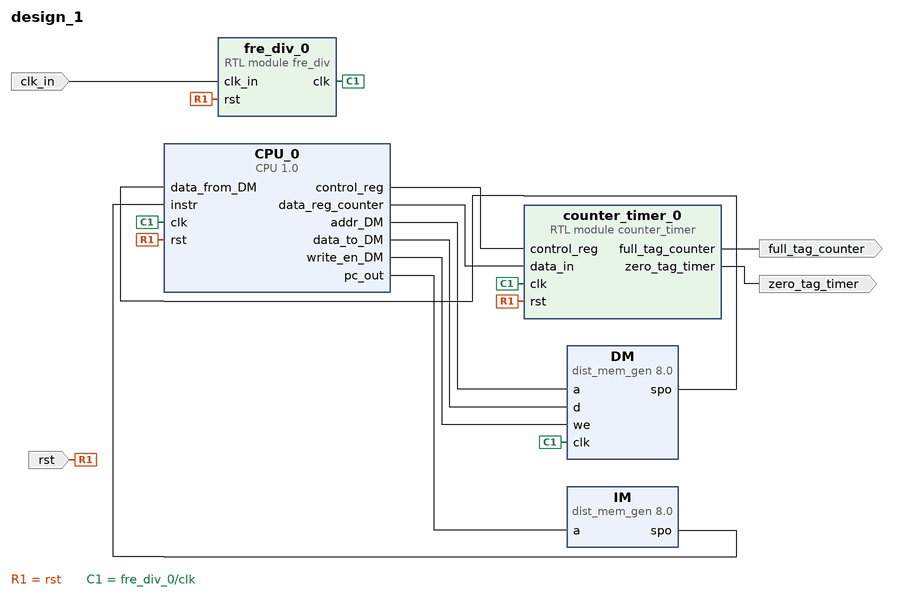
[diagram p0: block diagram of the top level]
# Vivado block design design_1, Vivado 2016.2
create_bd_design design_1

create_bd_port -dir O full_tag_counter
create_bd_port -dir O zero_tag_timer
create_bd_port -dir I clk_in
create_bd_port -dir I -type rst rst

create_bd_cell -type ip -vlnv xilinx.com:user:CPU:1.0 CPU_0
create_bd_cell -type ip -vlnv xilinx.com:ip:dist_mem_gen:8.0 IM
set_property -dict [list \
  CONFIG.depth 128 \
  CONFIG.data_width 32 \
  CONFIG.memory_type rom \
  CONFIG.coefficient_file ../../../../imports/MIPS_FPGA/IM.coe \
] [get_bd_cells IM]
create_bd_cell -type ip -vlnv xilinx.com:ip:dist_mem_gen:8.0 DM
set_property -dict [list \
  CONFIG.depth 128 \
  CONFIG.data_width 32 \
  CONFIG.coefficient_file ../../../../imports/MIPS_FPGA/DM.coe \
] [get_bd_cells DM]
create_bd_cell -type module -reference fre_div fre_div_0
create_bd_cell -type module -reference counter_timer counter_timer_0

# ---- connections ----

connect_bd_net -net dist_mem_gen_0_spo [get_bd_pins IM/spo] [get_bd_pins CPU_0/instr]
connect_bd_net [get_bd_pins CPU_0/pc_out] [get_bd_pins IM/a]
connect_bd_net [get_bd_pins CPU_0/addr_DM] [get_bd_pins DM/a]
connect_bd_net [get_bd_pins CPU_0/data_to_DM] [get_bd_pins DM/d]
connect_bd_net [get_bd_pins CPU_0/write_en_DM] [get_bd_pins DM/we]
connect_bd_net -net dist_mem_gen_1_spo [get_bd_pins DM/spo] [get_bd_pins CPU_0/data_from_DM]
connect_bd_net [get_bd_pins CPU_0/control_reg] [get_bd_pins counter_timer_0/control_reg]
connect_bd_net [get_bd_pins CPU_0/data_reg_counter] [get_bd_pins counter_timer_0/data_in]
connect_bd_net [get_bd_pins counter_timer_0/full_tag_counter] [get_bd_ports full_tag_counter]
connect_bd_net [get_bd_pins counter_timer_0/zero_tag_timer] [get_bd_ports zero_tag_timer]
connect_bd_net [get_bd_ports clk_in] [get_bd_pins fre_div_0/clk_in]
connect_bd_net [get_bd_ports rst] [get_bd_pins CPU_0/rst] [get_bd_pins fre_div_0/rst] [get_bd_pins counter_timer_0/rst]
connect_bd_net [get_bd_pins fre_div_0/clk] [get_bd_pins DM/clk] [get_bd_pins CPU_0/clk] [get_bd_pins counter_timer_0/clk]

validate_bd_design
save_bd_design
